# Altium project Incense.PrjPcb (part 2 of 2)

## Sheet 03_Incense_4G.SchDoc
size B; SheetNumber: 3
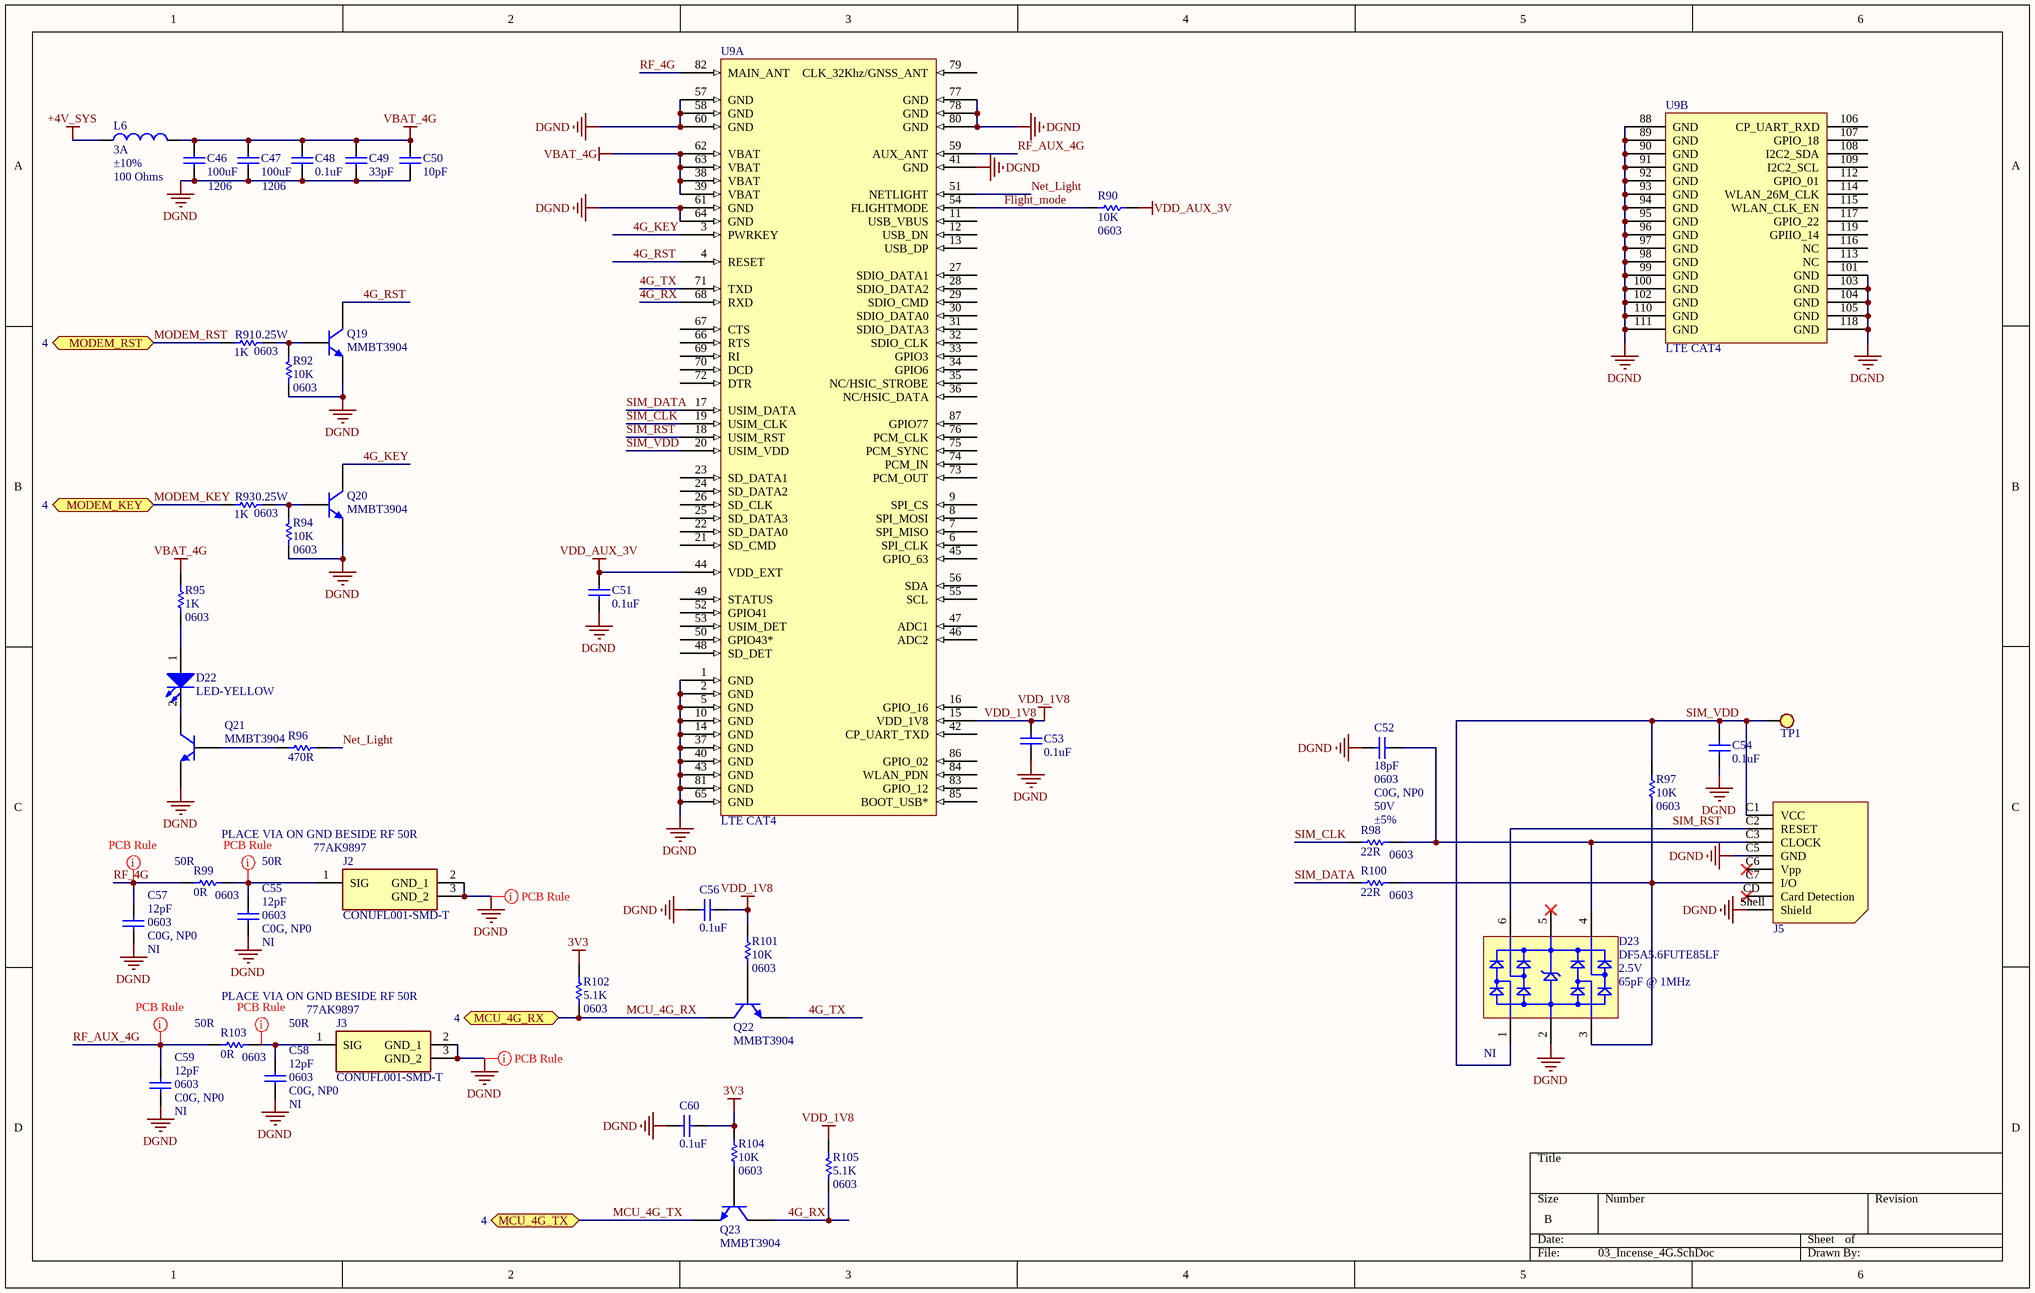
[diagram p3: 03_Incense_4G.SchDoc]

### Parts
C46  PCB FOOTPRINT: 1206  [CAP 1206]  (hidden comment: 100uF)
C47  PCB FOOTPRINT: 1206  [CAP 1206]  (hidden comment: 100uF)
C48  0.1uF  [CAP 0603]
C49  33pF  [CAP 0603]
C50  10pF  [CAP 0603]
C51  0.1uF  [CAP 0603]
C52  FOOTPRINT: 0603  Material: C0G, NP0  Voltage: 50V  Tolerance: ±5%  [CAP 0603]  (hidden comment: 18pF)
C53  0.1uF  [CAP 0603]
C54  0.1uF  [CAP 0603]
C55  value 12pF  FOOTPRINT: 0603  Material: C0G, NP0  [CAP 0603]  (hidden comment: NI)
C56  0.1uF  [CAP 0603]
C57  value 12pF  FOOTPRINT: 0603  Material: C0G, NP0  [CAP 0603]  (hidden comment: NI)
C58  value 12pF  FOOTPRINT: 0603  Material: C0G, NP0  [CAP 0603]  (hidden comment: NI)
C59  value 12pF  FOOTPRINT: 0603  Material: C0G, NP0  [CAP 0603]  (hidden comment: NI)
C60  0.1uF  [CAP 0603]
D22  LED-YELLOW  [LED 0603]
D23  DF5A5.6FUTE85LF  VOLTAGE: 2.5V  CAPACITANCE: 65pF @ 1MHz  NI_MARK: NI  [SC-70-6]
J2  CONUFL001-SMD-T  Supplier Part Number 1: 77AK9897  [CONUFL001-SMD]
J3  CONUFL001-SMD-T  Supplier Part Number 1: 77AK9897  [CONUFL001-SMD]
J5  693021020811  [693021020811]  (value not drawn)
L6  value 100 Ohms  Current: 3A  Tolerance: ±10%  [FB 0603]  (hidden comment: MPZ1608S101ATAH0)
Q19  MMBT3904  [SOT-23]
Q20  MMBT3904  [SOT-23]
Q21  MMBT3904  [SOT-23]
Q22  MMBT3904  [SOT-23]
Q23  MMBT3904  [SOT-23]
R90  PCB Footprint: 0603  [res 0603]  (hidden comment: 10K)
R91  PCB Footprint: 0603  Power: 0.25W  [res 0603]  (hidden comment: 1K)
R92  PCB Footprint: 0603  [res 0603]  (hidden comment: 10K)
R93  PCB Footprint: 0603  Power: 0.25W  [res 0603]  (hidden comment: 1K)
R94  PCB Footprint: 0603  [res 0603]  (hidden comment: 10K)
R95  PCB Footprint: 0603  [res 0603]  (hidden comment: 1K)
R96  470R  [res 0603]
R97  PCB Footprint: 0603  [res 0603]  (hidden comment: 10K)
R98  PCB Footprint: 0603  [res 0603]  (hidden comment: 22R)
R99  PCB Footprint: 0603  [res 0603]  (hidden comment: 0R)
R100  PCB Footprint: 0603  [res 0603]  (hidden comment: 22R)
R101  PCB Footprint: 0603  [res 0603]  (hidden comment: 10K)
R102  PCB Footprint: 0603  [res 0603]  (hidden comment: 5.1K)
R103  PCB Footprint: 0603  [res 0603]  (hidden comment: 0R)
R104  PCB Footprint: 0603  [res 0603]  (hidden comment: 10K)
R105  PCB Footprint: 0603  [res 0603]  (hidden comment: 5.1K)
TP1  TP SMD  [TESTPOINT]  (value not drawn)  (no BOM)
U9  LTE CAT4  [SIM7600C_L1]  (parts A,B of 2)

### Ports
MCU_4G_RX (bidir, see 4), MCU_4G_TX (bidir, see 4), MODEM_KEY (bidir, see 4), MODEM_RST (bidir, see 4)

### Nets
3V3: C60.2 R102.1 R104.1
+4V_SYS: L6.1
DGND: C46.2 C47.2 C48.2 C49.2 C50.2 C51.2 C52.2 C53.2 C54.2 C55.2 C56.2 C57.2 C58.2 C59.2 C60.1 D23.2(GND) J2.2(GND_1) J2.3(GND_2) J3.2(GND_1) J3.3(GND_2) J5.C5(GND) J5.Shell(Shield) Q19.2(E) Q20.2(E) Q21.2(E) R92.2 R94.2 U9.1(GND) U9.2(GND) U9.5(GND) U9.10(GND) U9.14(GND) U9.37(GND) U9.40(GND) U9.41(GND) U9.43(GND) U9.57(GND) U9.58(GND) U9.60(GND) U9.61(GND) U9.64(GND) U9.65(GND) U9.77(GND) U9.78(GND) U9.80(GND) U9.81(GND) U9.88(GND) U9.89(GND) U9.90(GND) U9.91(GND) U9.92(GND) U9.93(GND) U9.94(GND) U9.95(GND) U9.96(GND) U9.97(GND) U9.98(GND) U9.99(GND) U9.100(GND) U9.101(GND) U9.102(GND) U9.103(GND) U9.104(GND) U9.105(GND) U9.110(GND) U9.111(GND) U9.118(GND)
VBAT_4G: C46.1 C47.1 C48.1 C49.1 C50.1 L6.2 R95.2 U9.38(VBAT) U9.39(VBAT) U9.62(VBAT) U9.63(VBAT)
VDD_1V8: C53.1 C56.1 R101.1 R105.1 U9.15(VDD_1V8)
VDD_AUX_3V: C51.1 R90.1 U9.44(VDD_EXT)
4G_KEY: Q20.3(C) U9.3(PWRKEY)
4G_RST: Q19.3(C) U9.4(RESET)
4G_RX: Q23.3(C) R105.2 U9.68(RXD)
4G_TX: Q22.2(E) U9.71(TXD)
Flight_mode: R90.2 U9.54(FLIGHTMODE)
MCU_4G_RX: Q22.3(C) R102.2 ; port MCU_4G_RX
MCU_4G_TX: Q23.2(E) ; port MCU_4G_TX
MODEM_KEY: R93.2 ; port MODEM_KEY
MODEM_RST: R91.2 ; port MODEM_RST
Net_Light: R96.2 U9.51(NETLIGHT)
RF_4G: C57.1 R99.1 U9.82(MAIN_ANT)
RF_AUX_4G: C59.1 R103.1 U9.59(AUX_ANT)
SIM_CLK: R98.1 U9.19(USIM_CLK)
SIM_DATA: R100.1 U9.17(USIM_DATA)
SIM_RST: D23.6(I/O_4) J5.C2(RESET) U9.18(USIM_RST)
SIM_VDD: C54.1 D23.1(I/O_1) J5.C1(VCC) R97.1 TP1.1 U9.20(USIM_VDD)
NetC52_1: C52.1 D23.4(I/O_3) J5.C3(CLOCK) R98.2
NetC55_1: C55.1 J2.1(SIG) R99.2
NetC58_1: C58.1 J3.1(SIG) R103.2
NetD22_1: D22.1(A) R95.1
NetD22_2: D22.2(K) Q21.3(C)
NetD23_3: D23.3(I/O_2) J5.C7(I/O) R97.2 R100.2
NetQ19_1: Q19.1(B) R91.1 R92.1
NetQ20_1: Q20.1(B) R93.1 R94.1
NetQ21_1: Q21.1(B) R96.1
NetQ22_1: Q22.1(B) R101.2
NetQ23_1: Q23.1(B) R104.2

Not connected (* = marked no-connect by the designer): D23 5(VBUS)*; J5 C6(Vpp)* CD(Card_Detection)*; U9 6(SPI_CLK) 7(SPI_MISO) 8(SPI_MOSI) 9(SPI_CS) 11(USB_VBUS) 12(USB_DN) 13(USB_DP) 16(GPIO_16) 21(SD_CMD) 22(SD_DATA0) 23(SD_DATA1) 24(SD_DATA2) 25(SD_DATA3) 26(SD_CLK) 27(SDIO_DATA1) 28(SDIO_DATA2) 29(SDIO_CMD) 30(SDIO_DATA0) 31(SDIO_DATA3) 32(SDIO_CLK) 33(GPIO3) 34(GPIO6) 35(NC/HSIC_STROBE) 36(NC/HSIC_DATA) 42(CP_UART_TXD) 45(GPIO_63) 46(ADC2) 47(ADC1) 48(SD_DET) 49(STATUS) 50(GPIO43*) 52(GPIO41) 53(USIM_DET) 55(SCL) 56(SDA) 66(RTS) 67(CTS) 69(RI) 70(DCD) 72(DTR) 73(PCM_OUT) 74(PCM_IN) 75(PCM_SYNC) 76(PCM_CLK) 79(CLK_32Khz/GNSS_ANT) 83(GPIO_12) 84(WLAN_PDN) 85(BOOT_USB*) 86(GPIO_02) 87(GPIO77) 106(CP_UART_RXD) 107(GPIO_18) 108(I2C2_SDA) 109(I2C2_SCL) 112(GPIO_01) 113(NC) 114(WLAN_26M_CLK) 115(WLAN_CLK_EN) 116(NC) 117(GPIO_22) 119(GPIIO_14)

### Layout directives
rule Undefined; TRACE: 50R: NetC55_1, NetC58_1, RF_4G, RF_AUX_4G
rule Undefined; LAYOUT: PLACE VIA ON GND BESIDE RF 50R: DGND

### Library data of the parts
C46 C47 = Cap: CAP CER 100UF 6.3V X5R 1206; MANUFACTURER1: Taiyo Yuden; MANUFACTURER1_PART#: JMK316BJ107ML-T; MANUFACTURER2_PART#: JMK107BJ475KA-T; Unit: PCS; PACKING: Tape & Reel (TR); Process Type: SM; Tolerance: ±10%; CATEGORY: CAP-CER; VALUE: 100uF; Material: X5R; Voltage: 6.3V; MANUFACTURER2: Yageo
C48 C51 C53 C54 C56 C60 = Cap: CAP-CER,SMD;0.1UF,10%,50V,X7R,0603; MANUFACTURER1: Samsung Electro-Mechanics; MANUFACTURER1_PART#: CL10B104KB8NNNC; MANUFACTURER2_PART#: M0603X104K050TAX; MANUFACTURER1: SS; Unit: PCS; PACKING: Tape & Reel (TR); PCB FOOTPRINT: 0603; Process Type: SM; CATEGORY: CAP-CER; VALUE: 0.1uF; FOOTPRINT: 0603; Material: X7R; Voltage: 50V; Tolerance: ±10%; MANUFACTURER2: UWA
C49 = Cap: CAP CER 33PF 50V C0G/NPO 0603; MANUFACTURER1: Samsung Electro-Mechanics; MANUFACTURER1_PART#: CL10C330JB8NNNC; MANUFACTURER2_PART#: CC0603JRNPO9BN330; Unit: PCS; PACKING: Tape & Reel (TR); PCB FOOTPRINT: 0603; Process Type: SM; Tolerance: ±10%; CATEGORY: CAP-CER; VALUE: 33pF; FOOTPRINT: 0603; Material: C0G/NPO; Voltage: 50V; MANUFACTURER2: Yageo
C50 = Cap: CAP CER 10PF 50V C0G/NPO 0603; MANUFACTURER1: Samsung Electro-Mechanics; MANUFACTURER1_PART#: CL10C100JB8NNNC; MANUFACTURER2_PART#: CC0603JRNPO9BN100; Unit: PCS; Material: X7R; PACKING: Tape & Reel (TR); PCB FOOTPRINT: 0603; Process Type: SM; Tolerance: ±10%; CATEGORY: CAP-CER; VALUE: 10pF; FOOTPRINT: 0603; Voltage: 50V; MANUFACTURER2: Yageo
C52 = Cap: CAP CER 18PF 50V C0G/NP0 0603; MANUFACTURER1: Samsung; MANUFACTURER1_PART#: CL10C180JB81PNC; MANUFACTURER2_PART#: CC0603JRNPO9BN180; Unit: PCS; PACKING: Tape & Reel (TR); Process Type: SM; CATEGORY: CAP-CER; VALUE: 18pF; PCB FOOTPRINT: 0603; MANUFACTURER2: Yageo
C55 C57-C59 = Cap: CAP-CER,SMD;12PF,5%,50V,C0G/NPO 0603; MANUFACTURER1: Yageo; MANUFACTURER1_PART#: CC0603JRNPO9BN120; Unit: PCS; PACKING: Tape & Reel (TR); Process Type: SM; CATEGORY: CAP-CER; NI_MARK: NI; Voltage: 50V; PCB FOOTPRINT: 0603; Tolerance: ±5%
D22 = LED-RED: LED-SMD,2V,20mA,0603,RED; MANUFACTURER1: OSRAM; MANUFACTURER2_PART#: LTST-S270KSKT; MANUFACTURER1_PART#: LY Q396-P1Q2-36; PACKING: Tape & Reel (TR); PCB Footprint: 0603; Process Type: SM; Unit: PCS; Value: LED RED; Category: LED SMD; MANUFACTURER2: Lite-On Inc.
D23 = DIODES 5v TVS SOT-23-6: 2.5V TVS DIODE SOT23-6; MANUFACTURER1: Toshiba; MANUFACTURER1_PART#: DF5A5.6FUTE85LF; MANUFACTURER2: *; MANUFACTURER2_PART#: *; LOH_CODE: *; Value: DF5A5.6FUTE85LF; Category: TVS; CURRENT: *; POWER: *
J2 J3 = CONUFL001-SMD-T: RF Connectors / Coaxial Connectors T&R U.FL Straight Surface Mount Jack; MANUFACTURER1: Linx Technologies; MANUFACTURER2_PART#: 712-CONUFL001-SMD-T; Datasheet Link: https://linxtechnologies.com/wp/product/mhf-rf-connectors/; MANUFACTURER1_PART#: CONUFL001-SMD-T; MANUFACTURER2: TE Connectivity / Linx Technologies; Supplier 1: Newark
J5 = 693021020811: WR-CRD_SMT_MICROSIM_PUSH&PUSH_CD; Manufacturer: Wurth Elektronik; Match Code: WR-CRD; Contact Resistance: 100mOhm; Gender: Receptacle; Rated Current: 0.5A; Working Voltage: 50VAC; Withstanding Voltage: 500VAC; Manufacturer Part Number: 693021020811; Category: Input/Output Connectors; ComponentLink1Description: Website Link; ComponentLink1URL: https://www.we-online.com/redexpert/article/693021020811?ad; ComponentLink2Description: Datasheet Link; ComponentLink2URL: https://www.we-online.com/redexpert/spec/693021020811?ad; Mount: Surface Mount; Operating Temperature Max: 70°C; Operating Temperature Min: -20°C; Packaging: Tape and Reel; Number of Pins: 6; Type: Push & Push; MANUFACTURER1: Wurth Elektronik; MANUFACTURER1_PART#: 693021020811
L6 = inductor 2.2uF: FERRITE BEAD 100 OHM 0603 1LN; MANUFACTURER1: TDK Corporation; MANUFACTURER2_PART#: BLM18KG101TN1D; PACKING: Tape & Reel (TR); PCB Footprint: 0603; Process Type: SM; Unit: PCS; Category: Inductor; MANUFACTURER1_PART#: MPZ1608S101ATAH0; MANUFACTURER2: Murata Electronics
Q19-Q23 = NPN: as Q2 on sheet 02-Insence_interface; PACKAGE: SOT23; Category: TRANSISTOR; MANUFACTURER2: HT(Shenzhen Jinyu Semicon); MANUFACTURER2_PART#: MMBT3904; MANUFACTURER1_PART#: MMBT3904; Value: MMBT3904
R90 R92 R94 R97 R101 R104 = Res0.3: as R6 on sheet 02-Insence_interface; Value: 10K; CATEGORY: RES-SMD; MANUFACTURER2: UWA; Tolerance: ±5%
R91 R93 R95 = Res0.3: RES SMD,1K OHM,5%,1/10W,0603; MANUFACTURER1: Stackpole Electronics Inc; MANUFACTURER1_PART#: RMCF06031K00JNEAC; MANUFACTURER2_PART#: R0603J1KTG; DESCCRIPTION: RES SMD 1K OHM 5% 1/10W 0603; PACKING: Tape & Reel (TR); Process Type: SM; Unit: PCS; LOH_Code: 140100083; Value: 1K; CATEGORY: RES SMD; MANUFACTURER2: UWA
R96 = Res0.3: as R25 on sheet 02-Insence_interface; Value: 470R; CATEGORY: RES SMD; MANUFACTURER2: Stackpole; Tolerance: ±5%
R98 R100 = Res0.3: as R59 on sheet 02-Insence_interface; Value: 22R; CATEGORY: RES SMD; MANUFACTURER2: Stackpole Electronics Inc; Tolerance: 5%
R99 R103 = Res0.3: RES SMD 0 OHM JUMPER 1/10W 0603; MANUFACTURER1: Yageo; MANUFACTURER1_PART#: RC0603JR-070RL; MANUFACTURER2_PART#: RMCF0603ZT0R00; PACKING: Tape & Reel (TR); Process Type: SM; Unit: PCS; Power: 0.25W; Tolerance: 5%; Value: 0R; CATEGORY: RES SMD; MANUFACTURER2: Stackpole Electronics Inc
R102 R105 = Res0.3: RES SMD 5.1K OHM 1% 1/10W 0603; MANUFACTURER1: Yageo; MANUFACTURER1_PART#: RC0603FR-075K1L; PACKING: Tape & Reel (TR); Process Type: SM; Unit: PCS; Value: 5.1K; CATEGORY: RES SMD
TP1 = TP SMD: TEST POINT
U9 = SIM7600C_L1: MODULE 4G SIM7600C_L1; MANUFACTURER1: SIMCOM; MANUFACTURER1_PART#: A7600C-L1

## Sheet 04_Incense_MCU.SchDoc
size C; SheetNumber: 4
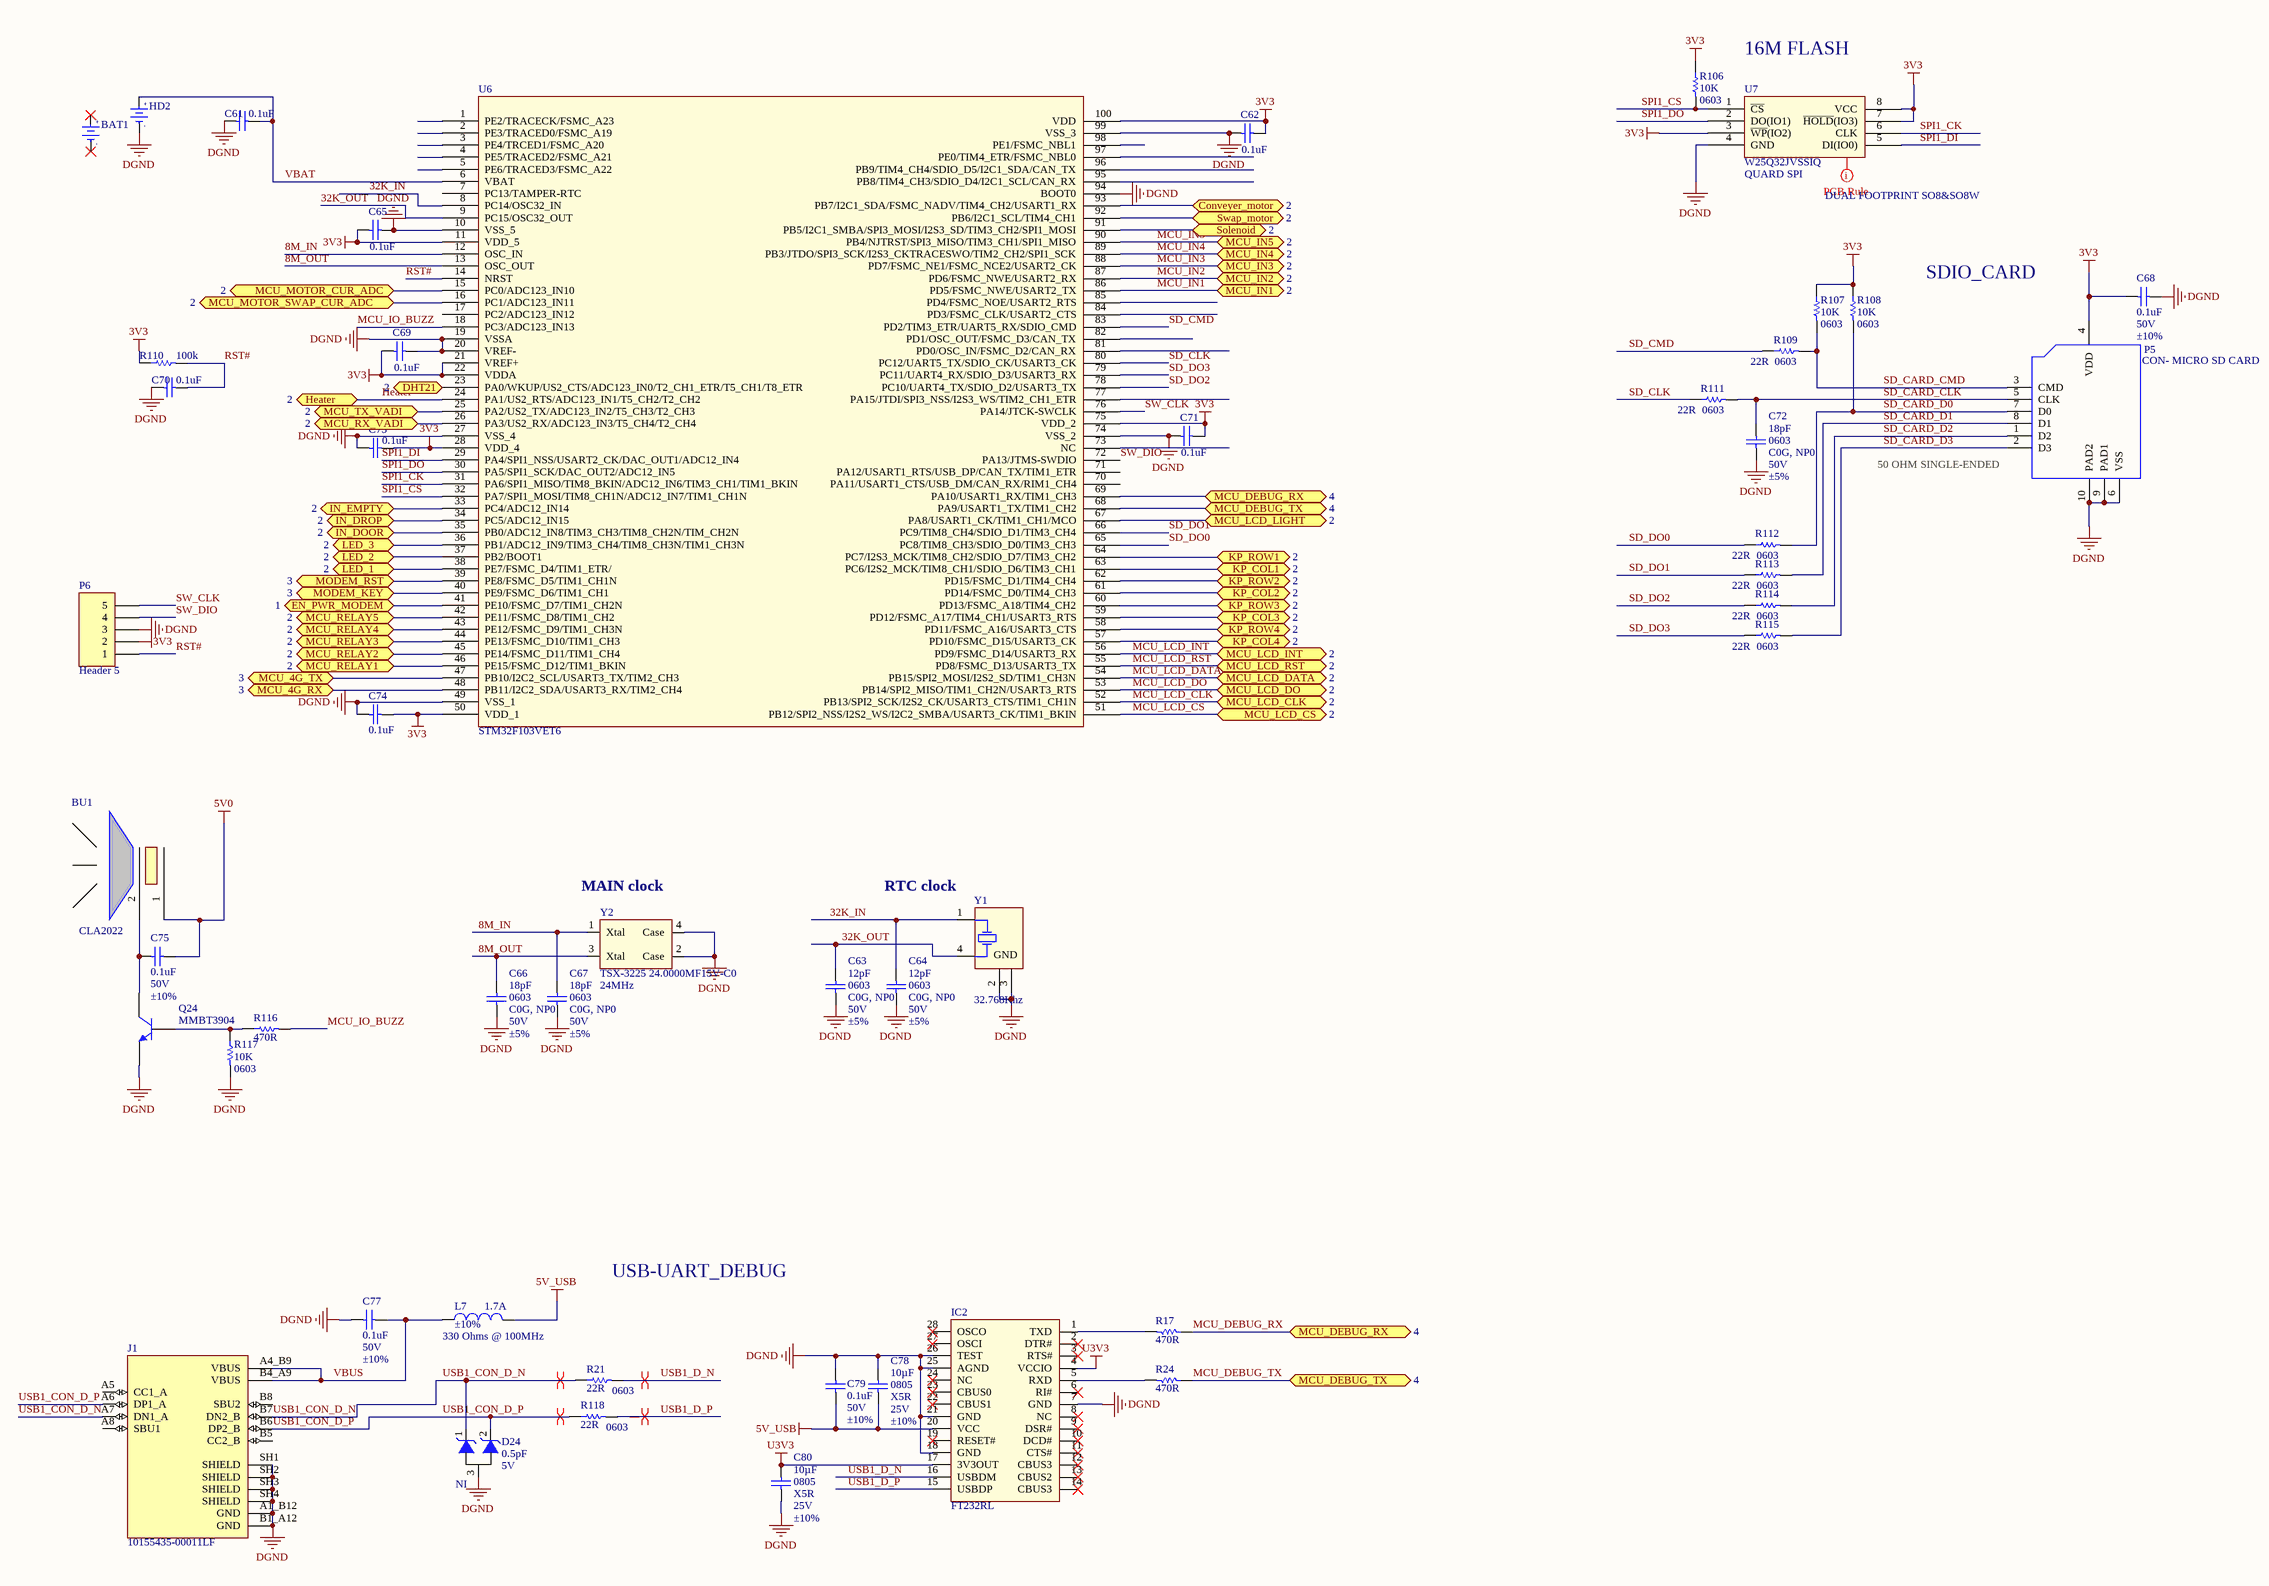
[diagram p4: 04_Incense_MCU.SchDoc]

### Parts
BAT1  CR1220  [De Pin Cr1220]  (value not drawn)  (mechanical)
BU1  CLA2022  [BUZZ_5V_D12X7.5MM]
C61  =Value: 0.1uF  [CAP 0603]  (hidden comment: 0.1uF,0805,16v)
C62  =Value: 0.1uF  [CAP 0603]  (hidden comment: Cap)
C63  FOOTPRINT: 0603  Material: C0G, NP0  Voltage: 50V  Tolerance: ±5%  [CAP 0603]  (hidden comment: 12pF)
C64  FOOTPRINT: 0603  Material: C0G, NP0  Voltage: 50V  Tolerance: ±5%  [CAP 0603]  (hidden comment: 12pF)
C65  =Value: 0.1uF  [cap 0603]  (hidden comment: Cap)
C66  FOOTPRINT: 0603  Material: C0G, NP0  Voltage: 50V  Tolerance: ±5%  [CAP 0603]  (hidden comment: 18pF)
C67  FOOTPRINT: 0603  Material: C0G, NP0  Voltage: 50V  Tolerance: ±5%  [CAP 0603]  (hidden comment: 18pF)
C68  Voltage: 50V  Tolerance: ±10%  [CAP 0603]  (hidden comment: 0.1uF)
C69  =Value: 0.1uF  [CAP 0603]  (hidden comment: Cap)
C70  =Value: 0.1uF  [CAP 0603]  (hidden comment: Cap)
C71  value 0.1uF  [CAP 0603]  (hidden comment: Cap)
C72  FOOTPRINT: 0603  Material: C0G, NP0  Voltage: 50V  Tolerance: ±5%  [CAP 0603]  (hidden comment: 18pF)
C73  value 0.1uF  [CAP 0603]  (hidden comment: Cap)
C74  value 0.1uF  [CAP 0603]  (hidden comment: Cap)
C75  Voltage: 50V  Tolerance: ±10%  [CAP 0603]  (hidden comment: 0.1uF)
C77  Voltage: 50V  Tolerance: ±10%  [CAP 0603]  (hidden comment: 0.1uF)
C78  Package: 0805  Voltage: 25V  Tolerance: ±10%  Material: X5R  [CAP 0805]  (hidden comment: 10µF)
C79  Voltage: 50V  Tolerance: ±10%  [CAP 0603]  (hidden comment: 0.1uF)
C80  Package: 0805  Voltage: 25V  Tolerance: ±10%  Material: X5R  [CAP 0805]  (hidden comment: 10µF)
D24  CAPACITANCE: 0.5pF  VOLTAGE: 5V  NI_MARK: NI  [SOT-416]  (hidden comment: ESDR0502BT1G)
HD2  CR1220-2ZX  [BATTERY HOLDER CR1220 SMD]  (value not drawn)
IC2  FT232RL  [FT232]
J1  10155435-00011LF  [AMPHENOL_10155435-00011LF]
L7  Current: 1.7A  Tolerance: ±10%  [FB 0603]  (hidden comment: 330 Ohms @ 100MHz)
P5  CON- MICRO SD CARD  [SD-01A]
P6  Header 5  [HDR1X5]
Q24  MMBT3904  [SOT-23]
R17  470R  [res 0603]
R21  PCB Footprint: 0603  [res 0603]  (hidden comment: 22R)
R24  470R  [res 0603]
R106  PCB Footprint: 0603  [res 0603]  (hidden comment: 10K)
R107  PCB Footprint: 0603  [res 0603]  (hidden comment: 10K)
R108  PCB Footprint: 0603  [res 0603]  (hidden comment: 10K)
R109  PCB Footprint: 0603  [res 0603]  (hidden comment: 22R)
R110  value 100k  [RES 0603]  (hidden comment: 100k, 0603)
R111  PCB Footprint: 0603  [res 0603]  (hidden comment: 22R)
R112  PCB Footprint: 0603  [res 0603]  (hidden comment: 22R)
R113  PCB Footprint: 0603  [res 0603]  (hidden comment: 22R)
R114  PCB Footprint: 0603  [res 0603]  (hidden comment: 22R)
R115  PCB Footprint: 0603  [res 0603]  (hidden comment: 22R)
R116  470R  [res 0603]
R117  PCB Footprint: 0603  [res 0603]  (hidden comment: 10K)
R118  PCB Footprint: 0603  [res 0603]  (hidden comment: 22R)
U6  STM32F103VET6  [LQFP100_N]
U7  W25Q32JVSSIQ  INTERFACE: QUARD SPI  [SOIC-8 208MIL]
Y1  32.768Khz  [MC-306]
Y2  MANUFACTURER1_PART#: TSX-3225 24.0000MF15V-C0  [Crystal 4SMD 32x25MM]  (hidden comment: 24MHz)

### Ports
Conveyer_motor (bidir, see 2), DHT21 (bidir, see 2), EN_PWR_MODEM (bidir, see 1), Heater (bidir, see 2), IN_DOOR (bidir, see 2), IN_DROP (bidir, see 2), IN_EMPTY (bidir, see 2), KP_COL1 (bidir, see 2), KP_COL2 (bidir, see 2), KP_COL3 (bidir, see 2), KP_COL4 (bidir, see 2), KP_ROW1 (bidir, see 2), KP_ROW2 (bidir, see 2), KP_ROW3 (bidir, see 2), KP_ROW4 (bidir, see 2), LED_1 (bidir, see 2), LED_2 (bidir, see 2), LED_3 (bidir, see 2), MCU_4G_RX (bidir, see 3), MCU_4G_TX (bidir, see 3), MCU_DEBUG_RX (bidir, see 4), MCU_DEBUG_TX (bidir, see 4), MCU_IN1 (bidir, see 2), MCU_IN2 (bidir, see 2), MCU_IN3 (bidir, see 2), MCU_IN4 (bidir, see 2), MCU_IN5 (bidir, see 2), MCU_LCD_CLK (bidir, see 2), MCU_LCD_CS (bidir, see 2), MCU_LCD_DATA (bidir, see 2), MCU_LCD_DO (bidir, see 2), MCU_LCD_INT (bidir, see 2), MCU_LCD_LIGHT (bidir, see 2), MCU_LCD_RST (bidir, see 2), MCU_MOTOR_CUR_ADC (bidir, see 2), MCU_MOTOR_SWAP_CUR_ADC (bidir, see 2), MCU_RELAY1 (bidir, see 2), MCU_RELAY2 (bidir, see 2), MCU_RELAY3 (bidir, see 2), MCU_RELAY4 (bidir, see 2), MCU_RELAY5 (bidir, see 2), MCU_RX_VADI (bidir, see 2), MCU_TX_VADI (bidir, see 2), MODEM_KEY (bidir, see 3), MODEM_RST (bidir, see 3), Solenoid (bidir, see 2), Swap_motor (bidir, see 2)

### Nets
3V3: C62.2 C65.1 C68.1 C69.1 C71.2 C73.1 C74.1 P5.4(VDD) P6.2 R106.1 R107.1 R108.1 R110.1 U6.11(VDD_5) U6.21(VREF+) U6.22(VDDA) U6.28(VDD_4) U6.50(VDD_1) U6.75(VDD_2) U6.100(VDD) U7.3(~{WP}(IO2)) U7.7(~{HOLD}(IO3)) U7.8(VCC)
5V0: BU1.1(PIN1) C75.2
5V_USB: C78.2 C79.1 IC2.20(VCC) L7.2
DGND: C61.1 C62.1 C63.2 C64.2 C65.2 C66.2 C67.2 C68.2 C69.2 C70.1 C71.1 C72.2 C73.2 C74.2 C77.1 C78.1 C79.2 C80.2 D24.3(A) HD2.2(GND) IC2.7(GND) IC2.18(GND) IC2.21(GND) IC2.25(AGND) IC2.26(TEST) J1.A1_B12(GND) J1.B1_A12(GND) J1.SH1(SHIELD) J1.SH2(SHIELD) J1.SH3(SHIELD) J1.SH4(SHIELD) P5.6(VSS) P5.9(PAD1) P5.10(PAD2) P6.3 Q24.2(E) R117.2 U6.10(VSS_5) U6.19(VSSA) U6.20(VREF-) U6.27(VSS_4) U6.49(VSS_1) U6.74(VSS_2) U6.94(BOOT0) U6.99(VSS_3) U7.4(GND) Y1.2(GND) Y1.3(GND) Y2.2(Case) Y2.4(Case)
U3V3: C80.1 IC2.4(VCCIO) IC2.17(3V3OUT)
8M_IN: C67.1 U6.12(OSC_IN) Y2.1(Xtal)
8M_OUT: C66.1 U6.13(OSC_OUT) Y2.3(Xtal)
32K_IN: C64.1 U6.8(PC14/OSC32_IN) Y1.1(XTAL)
32K_OUT: C63.1 U6.9(PC15/OSC32_OUT) Y1.4(XTAL)
Heater: U6.24(PA1/US2_RTS/ADC123_IN1/T5_CH2/T2_CH2) ; port Heater
IN_DOOR: U6.35(PB0/ADC12_IN8/TIM3_CH3/TIM8_CH2N/TIM_CH2N) ; port IN_DOOR
IN_DROP: U6.34(PC5/ADC12_IN15) ; port IN_DROP
IN_EMPTY: U6.33(PC4/ADC12_IN14) ; port IN_EMPTY
KP_COL1: U6.63(PC6/I2S2_MCK/TIM8_CH1/SDIO_D6/TIM3_CH1) ; port KP_COL1
KP_COL2: U6.61(PD14/FSMC_D0/TIM4_CH3) ; port KP_COL2
KP_COL3: U6.59(PD12/FSMC_A17/TIM4_CH1/USART3_RTS) ; port KP_COL3
KP_COL4: U6.57(PD10/FSMC_D15/USART3_CK) ; port KP_COL4
KP_ROW1: U6.64(PC7/I2S3_MCK/TIM8_CH2/SDIO_D7/TIM3_CH2) ; port KP_ROW1
KP_ROW2: U6.62(PD15/FSMC_D1/TIM4_CH4) ; port KP_ROW2
KP_ROW3: U6.60(PD13/FSMC_A18/TIM4_CH2) ; port KP_ROW3
KP_ROW4: U6.58(PD11/FSMC_A16/USART3_CTS) ; port KP_ROW4
LED_1: U6.38(PE7/FSMC_D4/TIM1_ETR/) ; port LED_1
LED_2: U6.37(PB2/BOOT1) ; port LED_2
LED_3: U6.36(PB1/ADC12_IN9/TIM3_CH4/TIM8_CH3N/TIM1_CH3N) ; port LED_3
MCU_4G_RX: U6.48(PB11/I2C2_SDA/USART3_RX/TIM2_CH4) ; port MCU_4G_RX
MCU_4G_TX: U6.47(PB10/I2C2_SCL/USART3_TX/TIM2_CH3) ; port MCU_4G_TX
MCU_DEBUG_RX: R17.1 U6.69(PA10/USART1_RX/TIM1_CH3) ; port MCU_DEBUG_RX
MCU_DEBUG_TX: R24.1 U6.68(PA9/USART1_TX/TIM1_CH2) ; port MCU_DEBUG_TX
MCU_IN1: U6.86(PD5/FSMC_NWE/USART2_TX) ; port MCU_IN1
MCU_IN2: U6.87(PD6/FSMC_NWE/USART2_RX) ; port MCU_IN2
MCU_IN3: U6.88(PD7/FSMC_NE1/FSMC_NCE2/USART2_CK) ; port MCU_IN3
MCU_IN4: U6.89(PB3/JTDO/SPI3_SCK/I2S3_CKTRACESWO/TIM2_CH2/SPI1_SCK) ; port MCU_IN4
MCU_IN5: U6.90(PB4/NJTRST/SPI3_MISO/TIM3_CH1/SPI1_MISO) ; port MCU_IN5
MCU_IO_BUZZ: R116.2 U6.18(PC3/ADC123_IN13)
MCU_LCD_CLK: U6.52(PB13/SPI2_SCK/I2S2_CK/USART3_CTS/TIM1_CH1N) ; port MCU_LCD_CLK
MCU_LCD_CS: U6.51(PB12/SPI2_NSS/I2S2_WS/I2C2_SMBA/USART3_CK/TIM1_BKIN) ; port MCU_LCD_CS
MCU_LCD_DATA: U6.54(PB15/SPI2_MOSI/I2S2_SD/TIM1_CH3N) ; port MCU_LCD_DATA
MCU_LCD_DO: U6.53(PB14/SPI2_MISO/TIM1_CH2N/USART3_RTS) ; port MCU_LCD_DO
MCU_LCD_INT: U6.56(PD9/FSMC_D14/USART3_RX) ; port MCU_LCD_INT
MCU_LCD_LIGHT: U6.67(PA8/USART1_CK/TIM1_CH1/MCO) ; port MCU_LCD_LIGHT
MCU_LCD_RST: U6.55(PD8/FSMC_D13/USART3_TX) ; port MCU_LCD_RST
MCU_MOTOR_CUR: U6.15(PC0/ADC123_IN10) ; port MCU_MOTOR_CUR_ADC
MCU_MOTOR_SWAP_CUR_ADC: U6.16(PC1/ADC123_IN11) ; port MCU_MOTOR_SWAP_CUR_ADC
MCU_RELAY1: U6.46(PE15/FSMC_D12/TIM1_BKIN) ; port MCU_RELAY1
MCU_RELAY2: U6.45(PE14/FSMC_D11/TIM1_CH4) ; port MCU_RELAY2
MCU_RELAY3: U6.44(PE13/FSMC_D10/TIM1_CH3) ; port MCU_RELAY3
MCU_RELAY4: U6.43(PE12/FSMC_D9/TIM1_CH3N) ; port MCU_RELAY4
MCU_RELAY5: U6.42(PE11/FSMC_D8/TIM1_CH2) ; port MCU_RELAY5
MCU_RX_VADI: U6.26(PA3/US2_RX/ADC123_IN3/T5_CH4/T2_CH4) ; port MCU_RX_VADI
MCU_TX_VADI: U6.25(PA2/US2_TX/ADC123_IN2/T5_CH3/T2_CH3) ; port MCU_TX_VADI
MODEM_KEY: U6.40(PE9/FSMC_D6/TIM1_CH1) ; port MODEM_KEY
MODEM_RST: U6.39(PE8/FSMC_D5/TIM1_CH1N) ; port MODEM_RST
RST#: C70.2 P6.1 R110.2 U6.14(NRST)
SD_CARD_CLK: C72.1 P5.5(CLK) R111.2
SD_CARD_CMD: P5.3(CMD) R107.2 R109.2
SD_CARD_D0: P5.7(D0) R108.2 R112.2
SD_CARD_D1: P5.8(D1) R113.2
SD_CARD_D2: P5.1(D2) R114.2
SD_CARD_D3: P5.2(D3) R115.2
SD_CLK: R111.1 U6.80(PC12/UART5_TX/SDIO_CK/USART3_CK)
SD_CMD: R109.1 U6.83(PD2/TIM3_ETR/UART5_RX/SDIO_CMD)
SD_DO0: R112.1 U6.65(PC8/TIM8_CH3/SDIO_D0/TIM3_CH3)
SD_DO1: R113.1 U6.66(PC9/TIM8_CH4/SDIO_D1/TIM3_CH4)
SD_DO2: R114.1 U6.78(PC10/UART4_TX/SDIO_D2/USART3_TX)
SD_DO3: R115.1 U6.79(PC11/UART4_RX/SDIO_D3/USART3_RX)
SPI1_CK: U6.31(PA6/SPI1_MISO/TIM8_BKIN/ADC12_IN6/TIM3_CH1/TIM1_BKIN) U7.6(CLK)
SPI1_CS: R106.2 U6.32(PA7/SPI1_MOSI/TIM8_CH1N/ADC12_IN7/TIM1_CH1N) U7.1(~{CS})
SPI1_DI: U6.29(PA4/SPI1_NSS/USART2_CK/DAC_OUT1/ADC12_IN4) U7.5(DI(IO0))
SPI1_DO: U6.30(PA5/SPI1_SCK/DAC_OUT2/ADC12_IN5) U7.2(DO(IO1))
SW_CLK: P6.5 U6.76(PA14/JTCK-SWCLK)
SW_DIO: P6.4 U6.72(PA13/JTMS-SWDIO)
USB1_CON_D_N: D24.1(K) J1.A7(DN1_A) J1.B7(DN2_B) R21.1
USB1_CON_D_P: D24.2(K) J1.A6(DP1_A) J1.B6(DP2_B) R118.1
USB1_D_N: IC2.16(USBDM) R21.2
USB1_D_P: IC2.15(USBDP) R118.2
VBAT: C61.2 HD2.1(+3V) U6.6(VBAT)
VBUS: C77.2 J1.A4_B9(VBUS) J1.B4_A9(VBUS) L7.1
NetBU1_2: BU1.2(PIN2) C75.1 Q24.3(C)
NetIC2_1: IC2.1(TXD) R17.2
NetIC2_5: IC2.5(RXD) R24.2
NetJ7_2: U6.23(PA0/WKUP/US2_CTS/ADC123_IN0/T2_CH1_ETR/T5_CH1/T8_ETR) ; port DHT21
NetQ24_1: Q24.1(B) R116.1 R117.1
NetR5_2: U6.41(PE10/FSMC_D7/TIM1_CH2N) ; port EN_PWR_MODEM
NetR50_2: U6.93(PB7/I2C1_SDA/FSMC_NADV/TIM4_CH2/USART1_RX) ; port Conveyer_motor
NetR61_2: U6.92(PB6/I2C1_SCL/TIM4_CH1) ; port Swap_motor
NetR63_2: U6.91(PB5/I2C1_SMBA/SPI3_MOSI/I2S3_SD/TIM3_CH2/SPI1_MOSI) ; port Solenoid

Not connected (* = marked no-connect by the designer): BAT1 1(+3V)* 2(GND)*; IC2 2(DTR#)* 3(RTS#)* 6(RI#)* 8(NC)* 9(DSR#)* 10(DCD#)* 11(CTS#)* 12(CBUS3)* 13(CBUS2)* 14(CBUS3)* 19(RESET#)* 22(CBUS1)* 23(CBUS0)* 24(NC)* 27(OSCI)* 28(OSCO)*; J1 A5(CC1_A) A8(SBU1) B5(CC2_B) B8(SBU2); U6 1(PE2/TRACECK/FSMC_A23) 2(PE3/TRACED0/FSMC_A19) 3(PE4/TRCED1/FSMC_A20) 4(PE5/TRACED2/FSMC_A21) 5(PE6/TRACED3/FSMC_A22) 7(PC13/TAMPER-RTC) 17(PC2/ADC123_IN12) 70(PA11/USART1_CTS/USB_DM/CAN_RX/RIM1_CH4) 71(PA12/USART1_RTS/USB_DP/CAN_TX/TIM1_ETR) 73(NC) 77(PA15/JTDI/SPI3_NSS/I2S3_WS/TIM2_CH1_ETR) 81(PD0/OSC_IN/FSMC_D2/CAN_RX) 82(PD1/OSC_OUT/FSMC_D3/CAN_TX) 84(PD3/FSMC_CLK/USART2_CTS) 85(PD4/FSMC_NOE/USART2_RTS) 95(PB8/TIM4_CH3/SDIO_D4/I2C1_SCL/CAN_RX) 96(PB9/TIM4_CH4/SDIO_D5/I2C1_SDA/CAN_TX) 97(PE0/TIM4_ETR/FSMC_NBL0) 98(PE1/FSMC_NBL1)

### Layout directives
rule Undefined; FOOTPRINT: DUAL FOOTPRINT SO8&SO8W: (no net found under the mark)
differential pair: USB1_CON_D_N, USB1_CON_D_P, USB1_D_N, USB1_D_P

### Notes on the sheet
- 16M FLASH
- SDIO_CARD
- 50 OHM SINGLE-ENDED
- (near Y2) MAIN clock
- (near Y1) RTC clock
- USB-UART_DEBUG
- (in symbol CR1220 SMD) +; -

### Library data of the parts
BAT1 = CR1220 SMD: CR1220 BATTERY; MANUFACTURER1_PART#: PIN CR1220 Lithium; PROCESS_TYPE: DIP; Category: BATTERY; MANUFACTURER1: http://linhkienchatluong.vn/pin-cac-loai/pin-cr1220-lithium_sp540_ct5222.aspx; LOH_CODE: *; Value: CR1220
BU1 = PKM13EPYH4000: BUZZ 5V 12095 12x9.5mm; MANUFACTURER1: LKCL; MANUFACTURER2_PART#: 5V 9.5x12MM; LOH_Code: *; Category: PASSIVE; Value: CLA2022; MANUFACTURER1_PART#: CLA2022; MANUFACTURER2: https://banlinhkien.com/coi-chip-5v-9.5x12mm-p6653467.html
C61 C62 C65 C69 C70 = Cap: CAP CER 0.1UF 50V X7R 0603; MANUFACTURER1: Samsung Electro-Mechanics; MANUFACTURER1_PART#: CL10B104KB8NNNC; Published: 8-Jun-2000; LatestRevisionDate: 17-Jul-2002; LatestRevisionNote: Re-released for DXP Platform.; PackageReference: RAD-0.3; Publisher: Altium Limited; PackageDescription: Radial Cap, Thru-Hole; 2 Leads; 0.3 in Pin Spacing
C63 C64 = Cap: CAP-CER,SMD;12PF,5%,50V,C0G/NPO 0603; MANUFACTURER1: Yageo; MANUFACTURER1_PART#: CC0603JRNPO9BN120; DESCCRIPTION: CAP CER 20PF 50V C0G/NPO 0603; PROC: SM; Unit: PCS; PACKING: Tape & Reel (TR); don vi cung cap: shop; CATEGORY: CAP-CER; VALUE: 12pF; PCB FOOTPRINT: 0603; Process Type: SM
C66 C67 C72 = Cap: CAP CER 18PF 50V C0G/NP0 0603; MANUFACTURER1: Samsung; MANUFACTURER1_PART#: CL10C180JB81PNC; MANUFACTURER2_PART#: CC0603JRNPO9BN180; Unit: PCS; PACKING: Tape & Reel (TR); Process Type: SM; CATEGORY: CAP-CER; VALUE: 18pF; PCB FOOTPRINT: 0603; MANUFACTURER2: Yageo
C68 = Cap: CAP-CER,SMD;0.1UF,10%,50V,X7R,0603; MANUFACTURER1: Samsung Electro-Mechanics; MANUFACTURER1_PART#: CL10B104KB8NNNC; MANUFACTURER2_PART#: M0603X104K050TAX; Unit: PCS; PACKING: Tape & Reel (TR); PCB FOOTPRINT: 0603; Process Type: SM; LOH_Code: 101100038; CATEGORY: CAP-CER; VALUE: 0.1uF; FOOTPRINT: 0603; Material: X7R; MANUFACTURER2: UWA; Parameter 1: *
C71 C73 C74 = Cap: CAP-CER,SMD;0.1UF,10%,50V,X7R,0603; MANUFACTURER1: Samsung Electro-Mechanics; MANUFACTURER1_PART#: CL10B104KB8NNNC; Published: 8-Jun-2000; LatestRevisionDate: 17-Jul-2002; LatestRevisionNote: Re-released for DXP Platform.; PackageReference: RAD-0.3; Publisher: Altium Limited; PackageDescription: Radial Cap, Thru-Hole; 2 Leads; 0.3 in Pin Spacing
C75 C77 C79 = Cap: CAP-CER,SMD;0.1UF,10%,50V,X7R,0603; MANUFACTURER1: Samsung Electro-Mechanics; MANUFACTURER1_PART#: CL10B104KB8NNNC; MANUFACTURER2_PART#: M0603X104K050TAX; MANUFACTURER1: SS; Unit: PCS; PACKING: Tape & Reel (TR); PCB FOOTPRINT: 0603; Process Type: SM; CATEGORY: CAP-CER; VALUE: 0.1uF; FOOTPRINT: 0603; Material: X7R; MANUFACTURER2: UWA
C78 C80 = Cap-NP-100: CAP-CER,SMD;10UF,10%,25V,X5R,0805; MANUFACTURER1: Taiyo Yuden; MANUFACTURER1_PART#: TMK212BBJ106KG-T; MANUFACTURER2_PART#: CL21A106KAYNNNG; PACKING: Tape & Reel (TR); Process Type: SM; Unit: PCS; Value: 10µF; CATEGORY: CAP_CER; MANUFACTURER2: Samsung; PCB Footprint: 0805
D24 = TVS_DUAL_SIGNAL_5V_SOT23: 5V, ESD PROTECTION DEVICES, SOT-23; MANUFACTURER2_PART#: DF3D6.8MS,LF; MANUFACTURER1: ON Semiconductor; CURRENT: 1A; POWER: 320W; Category: TVS; MANUFACTURER1_PART#: ESDR0502BT1G; MANUFACTURER2: Toshiba; Value: ESDR0502BT1G; LOH_CODE: *
HD2 = CR1220 SMD: CR1220 SMD HOLDER; MANUFACTURER2_PART#: BH-122A-5; MANUFACTURER1: Q&J; PROCESS_TYPE: SM; MANUFACTURER1_PART#: CR1220-2ZX; Category: HOLDER; LOH_CODE: *; Value: CR1220-2ZX; MANUFACTURER2: Adam Tech
IC2 = PL2303HX: IC USB FS SERIAL UART 28-SSOP; MANUFACTURER1: FTDI, Future Technology Devices International Ltd; MANUFACTURER1_PART#: FT232RL-REEL; Value: FT232RL; Footprint: SOP28; MANUFACTURER2_PART#: PL2303HX; LOH_CODE: *; MANUFACTURER2: PROFILIC; CATEGORY: IC
J1 = 10155435-00011LF: USB TYPE C R/A SMT 16PIN; MF: Amphenol ICC (FCI); Package: None; Price: None; Value: *; MP: 10155435-00011LF; Availability: Unavailable; MANUFACTURER1: Amphenol ICC (FCI); MANUFACTURER1_PART#: 10155435-00011LF
L7 = inductor 2.2uF: FERRITE BEAD 330 OHM 0603 1LN; MANUFACTURER1: TDK Corporation; MANUFACTURER1_PART#: MPZ1608S331ATA00; MANUFACTURER2_PART#: BLM18KG331SN1D; PACKING: Tape & Reel (TR); PCB Footprint: 0603; Process Type: SM; Unit: PCS; Category: Inductor; DESCRIPTION_: FERRITE BEAD 330 OHM 0603 1LN; MANUFACTURER2: Murata Electronics; Value: 330 Ohms @ 100MHz
P5 = CON- MICRO SD CARD: SMD Card Sockets; MANUFACTURER1: Korean Hroparts Elec; Value: Re-released for DXP Platform.; PROCESS_TYPE: SM; Category: CONNECTOR; MANUFACTURER2_PART#: *; LOH_CODE: *; MANUFACTURER2: *; MANUFACTURER1_PART#: SD-01A
P6 = Header 5: Header, 5-Pin,2.54mm; LatestRevisionDate: 17-Jul-2002; LatestRevisionNote: Re-released for DXP Platform.; Publisher: Altium Limited
Q24 = NPN: NPN 200mA 40V 350mW SOT-23 Transistors; MANUFACTURER1: Guangdong Hottech; PROCESS_TYPE: SM; PACKAGE: SOT23; Category: TRANSISTOR; MANUFACTURER2: HT(Shenzhen Jinyu Semicon); MANUFACTURER2_PART#: MMBT3904; MANUFACTURER1_PART#: MMBT3904; Value: MMBT3904
R17 R24 R116 = Res0.3: RES SMD, 470 OHM 5% 1/8W 0603; MANUFACTURER1: KOA Speer Electronics, Inc.; MANUFACTURER1_PART#: RK73B1JTTD471J; MANUFACTURER2_PART#: RMCF0603JT470R; PACKING: Tape & Reel (TR); PCB Footprint: 0603; Process Type: SM; Unit: PCS; Power: 0.25W; Value: 470R; CATEGORY: RES SMD; MANUFACTURER2: Stackpole; Tolerance: ±5%
R21 R109 R111-R115 R118 = Res0.3: RES 22 OHM 5% 1/10W 0603; MANUFACTURER1: Yageo; MANUFACTURER1_PART#: RC0603JR-0722RL; MANUFACTURER2_PART#: RMCF0603JT22R0; PACKING: Tape & Reel (TR); Process Type: SM; Unit: PCS; Power: 0.25W; Value: 22R; CATEGORY: RES SMD; MANUFACTURER2: Stackpole Electronics Inc; Tolerance: 5%
R106-R108 R117 = Res0.3: RES SMD,10K OHM 5% 1/10W 0603; MANUFACTURER1: Stackpole Electronics Inc; MANUFACTURER1_PART#: RMCF0603JT10K0; MANUFACTURER2_PART#: R0603J10KKDX; PACKING: Tape & Reel (TR); Process Type: SM; Unit: PCS; Power: 0.25W; Value: 10K; CATEGORY: RES-SMD; MANUFACTURER2: UWA; Tolerance: ±5%
R110 = Res1: RES 100K OHM 1% 1/10W 0603; MANUFACTURER1: Stackpole Electronics Inc; MANUFACTURER1_PART#: RMCF0603FT100K; Published: 8-Jun-2000; LatestRevisionDate: 17-Jul-2002; LatestRevisionNote: Re-released for DXP Platform.; PackageReference: AXIAL-0.3; Publisher: Altium Limited; PackageDescription: Axial Device, Thru-Hole; 2 Leads; 0.3 in Pin Spacing
U6 = STM32F103VET6: IC MCU 32BIT 512KB FLASH 100LQFP; MANUFACTURER1: STMicroelectronics; MANUFACTURER1_PART#: STM32F103VET6
U7 = IC Flash W25Q16JVSNIQ QUAD SO8: IC FLASH 32MBIT SPI/QUAD 8SOIC; MANUFACTURER1: Winbond Electronics; PACKING: Tape & Reel (TR); PCB Footprint: SO8; Process Type: SM; Unit: PCS; Voltage: 2.7V ~ 3.6V; Category: IC; MANUFACTURER1_PART#: W25Q32JVSSIQ; Value: W25Q32JVSSIQ
Y1 = XT4_32.768KHZ: CRYSTAL 32.7680KHZ 12.5PF SMD; MANUFACTURER1: TDK; MANUFACTURER1_PART#: TKD M8-32.768KHZ-12.5PF-20PPM; Frequency Tolerance: ±20ppm; ESR: 65 kOhms; MANUFACTURER2_PART#: *; MANUFACTURER2: *; LOH_CODE: *; CATEGORY: CRYSTAL; SIZE: 0.264" L x 0.059" W (6.70mm x 1.50mm); Load Capacitance: 12.5pF; Frequency: 32.768 kHz; Value: 32.768Khz
Y2 = Crystal FL0800008Q: CRYSTAL 24.0000MHZ 18PF SMD; MANUFACTURER1: ECS Inc.; PACKING: Tape & Reel (TR); PCB Footprint: 3.20mm x 2.50mm; Process Type: SM; Tolerance: ±20ppm; Unit: PCS; Category: Crystals; Value: 24MHz

## Nets that join several sheets
3V3: 01-Insence_Power (C17.1 C18.1 U1.2 U1.4), 02-Insence_interface (14 pins), 03_Incense_4G (C60.2 R102.1 R104.1), 04_Incense_MCU (23 pins)
5V0: 01-Insence_Power (C22.1 C23.1 U3.2 U3.4), 02-Insence_interface (L3.1), 04_Incense_MCU (BU1.1 C75.2)
+4V_SYS: 01-Insence_Power (6 pins), 03_Incense_4G (L6.1)
+24V_SYS: 01-Insence_Power (9 pins), 02-Insence_interface (25 pins)
DGND: 01-Insence_Power (32 pins), 02-Insence_interface (77 pins), 03_Incense_4G (67 pins), 04_Incense_MCU (50 pins)
Heater: 02-Insence_interface (R76.2), 04_Incense_MCU (U6.24)
IN_DOOR: 02-Insence_interface (C25.2 R8.1 Z1.1), 04_Incense_MCU (U6.35)
IN_DROP: 02-Insence_interface (C26.2 R20.1 Z2.1), 04_Incense_MCU (U6.34)
IN_EMPTY: 02-Insence_interface (C27.2 R28.1 Z3.1), 04_Incense_MCU (U6.33)
KP_COL1: 02-Insence_interface (R29.1), 04_Incense_MCU (U6.63)
KP_COL2: 02-Insence_interface (R32.1), 04_Incense_MCU (U6.61)
KP_COL3: 02-Insence_interface (R33.1), 04_Incense_MCU (U6.59)
KP_COL4: 02-Insence_interface (R34.1), 04_Incense_MCU (U6.57)
KP_ROW1: 02-Insence_interface (R35.1), 04_Incense_MCU (U6.64)
KP_ROW2: 02-Insence_interface (R36.1), 04_Incense_MCU (U6.62)
KP_ROW3: 02-Insence_interface (R37.1), 04_Incense_MCU (U6.60)
KP_ROW4: 02-Insence_interface (R38.1), 04_Incense_MCU (U6.58)
LED_1: 02-Insence_interface (R43.2), 04_Incense_MCU (U6.38)
LED_2: 02-Insence_interface (R42.2), 04_Incense_MCU (U6.37)
LED_3: 02-Insence_interface (R44.2), 04_Incense_MCU (U6.36)
MCU_4G_RX: 03_Incense_4G (Q22.3 R102.2), 04_Incense_MCU (U6.48)
MCU_4G_TX: 03_Incense_4G (Q23.2), 04_Incense_MCU (U6.47)
MCU_IN1: 02-Insence_interface (C41.2 R66.1 Z4.1), 04_Incense_MCU (U6.86)
MCU_IN2: 02-Insence_interface (C43.2 R74.1 Z6.1), 04_Incense_MCU (U6.87)
MCU_IN3: 02-Insence_interface (C45.2 R84.1 Z8.1), 04_Incense_MCU (U6.88)
MCU_IN4: 02-Insence_interface (C42.2 R67.1 Z5.1), 04_Incense_MCU (U6.89)
MCU_IN5: 02-Insence_interface (C44.2 R75.1 Z7.1), 04_Incense_MCU (U6.90)
MCU_LCD_CLK: 02-Insence_interface (R12.1), 04_Incense_MCU (U6.52)
MCU_LCD_CS: 02-Insence_interface (R7.1), 04_Incense_MCU (U6.51)
MCU_LCD_DATA: 02-Insence_interface (R9.1), 04_Incense_MCU (U6.54)
MCU_LCD_DO: 02-Insence_interface (R16.1), 04_Incense_MCU (U6.53)
MCU_LCD_INT: 02-Insence_interface (R14.1), 04_Incense_MCU (U6.56)
MCU_LCD_LIGHT: 02-Insence_interface (R25.2), 04_Incense_MCU (U6.67)
MCU_LCD_RST: 02-Insence_interface (R13.1), 04_Incense_MCU (U6.55)
MCU_MOTOR_CUR: 02-Insence_interface (C82.2 R121.2), 04_Incense_MCU (U6.15)
MCU_MOTOR_SWAP_CUR_ADC: 02-Insence_interface (C84.2 R125.1), 04_Incense_MCU (U6.16)
MCU_RELAY1: 02-Insence_interface (R87.2), 04_Incense_MCU (U6.46)
MCU_RELAY2: 02-Insence_interface (R77.2), 04_Incense_MCU (U6.45)
MCU_RELAY3: 02-Insence_interface (R88.2), 04_Incense_MCU (U6.44)
MCU_RELAY4: 02-Insence_interface (R78.2), 04_Incense_MCU (U6.43)
MCU_RELAY5: 02-Insence_interface (R89.2), 04_Incense_MCU (U6.42)
MCU_RX_VADI: 02-Insence_interface (Q7.3 R55.2), 04_Incense_MCU (U6.26)
MCU_TX_VADI: 02-Insence_interface (Q10.2), 04_Incense_MCU (U6.25)
MODEM_KEY: 03_Incense_4G (R93.2), 04_Incense_MCU (U6.40)
MODEM_RST: 03_Incense_4G (R91.2), 04_Incense_MCU (U6.39)
NetJ7_2: 02-Insence_interface (J7.2 R15.1), 04_Incense_MCU (U6.23)
NetR5_2: 01-Insence_Power (R5.2), 04_Incense_MCU (U6.41)
NetR50_2: 02-Insence_interface (R50.2), 04_Incense_MCU (U6.93)
NetR61_2: 02-Insence_interface (R61.2), 04_Incense_MCU (U6.92)
NetR63_2: 02-Insence_interface (R63.2), 04_Incense_MCU (U6.91)